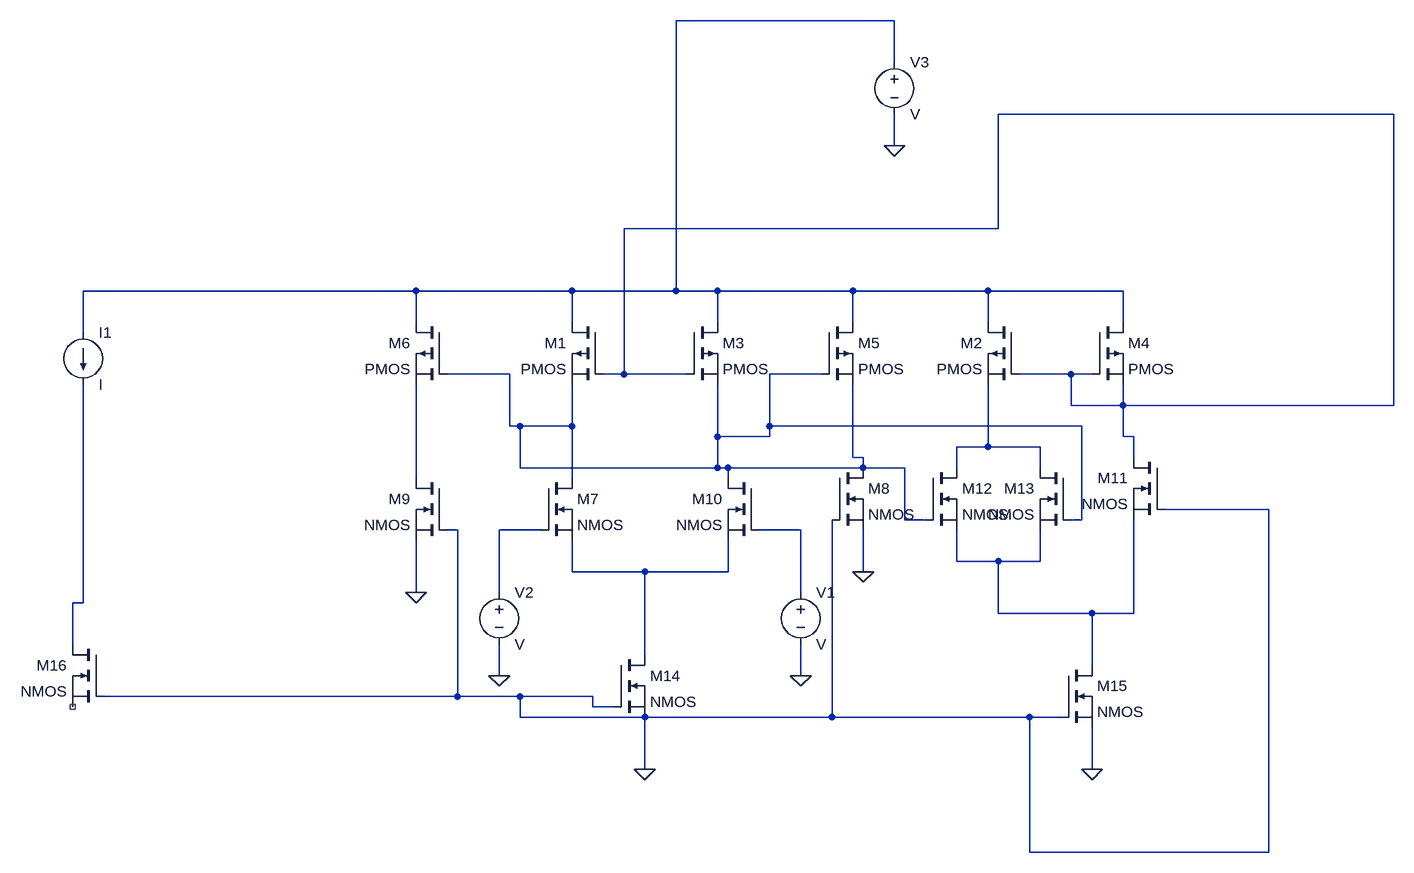
[diagram p0: schematic cmfb_error_amplifier.asc]
cmfb_error_amplifier.asc, the LTspice schematic file:
Version 4
SHEET 1 1284 740
WIRE 512 -544 176 -544
WIRE 512 -480 512 -544
WIRE 1280 -400 672 -400
WIRE 512 -352 512 -400
WIRE 672 -224 672 -400
WIRE 672 -224 96 -224
WIRE -224 -128 -736 -128
WIRE 16 -128 -224 -128
WIRE 176 -128 176 -544
WIRE 176 -128 16 -128
WIRE 240 -128 176 -128
WIRE 448 -128 240 -128
WIRE 656 -128 448 -128
WIRE 864 -128 656 -128
WIRE -224 -80 -224 -128
WIRE 16 -80 16 -128
WIRE 240 -80 240 -128
WIRE 448 -80 448 -128
WIRE 656 -80 656 -128
WIRE 864 -80 864 -128
WIRE -736 -64 -736 -128
WIRE -80 0 -176 0
WIRE 96 0 96 -224
WIRE 96 0 64 0
WIRE 192 0 96 0
WIRE 400 0 320 0
WIRE 784 0 704 0
WIRE 816 0 784 0
WIRE 784 48 784 0
WIRE 864 48 864 16
WIRE 864 48 784 48
WIRE 1280 48 1280 -400
WIRE 1280 48 864 48
WIRE -80 80 -80 0
WIRE -64 80 -80 80
WIRE 16 80 16 16
WIRE 16 80 -64 80
WIRE 320 80 320 0
WIRE 800 80 320 80
WIRE 240 96 240 16
WIRE 320 96 320 80
WIRE 320 96 240 96
WIRE 864 96 864 48
WIRE 880 96 864 96
WIRE 656 112 656 16
WIRE 656 112 608 112
WIRE 736 112 656 112
WIRE 448 128 448 16
WIRE 464 128 448 128
WIRE 880 128 880 96
WIRE -64 144 -64 80
WIRE 240 144 240 96
WIRE 240 144 -64 144
WIRE 256 144 240 144
WIRE 464 144 464 128
WIRE 464 144 256 144
WIRE 528 144 464 144
WIRE 608 144 608 112
WIRE 736 144 736 112
WIRE -224 160 -224 16
WIRE 16 160 16 80
WIRE 256 160 256 144
WIRE 1088 208 928 208
WIRE 528 224 528 144
WIRE 560 224 528 224
WIRE 800 224 800 80
WIRE 800 224 784 224
WIRE -160 240 -176 240
WIRE -32 240 -96 240
WIRE 368 240 304 240
WIRE 608 288 608 240
WIRE 672 288 608 288
WIRE 736 288 736 240
WIRE 736 288 672 288
WIRE 16 304 16 256
WIRE 128 304 16 304
WIRE 256 304 256 256
WIRE 256 304 128 304
WIRE 464 304 464 240
WIRE -224 336 -224 256
WIRE -96 336 -96 240
WIRE 368 336 368 240
WIRE -736 352 -736 16
WIRE -736 352 -752 352
WIRE 672 368 672 288
WIRE 816 368 672 368
WIRE 880 368 880 224
WIRE 880 368 816 368
WIRE -752 416 -752 352
WIRE 128 432 128 304
WIRE 816 448 816 368
WIRE -96 464 -96 416
WIRE 368 464 368 416
WIRE -160 496 -160 240
WIRE -160 496 -704 496
WIRE -64 496 -160 496
WIRE 48 496 -64 496
WIRE 48 512 48 496
WIRE 80 512 48 512
WIRE -64 528 -64 496
WIRE 128 528 -64 528
WIRE 416 528 416 224
WIRE 416 528 128 528
WIRE 720 528 416 528
WIRE 768 528 720 528
WIRE 128 608 128 528
WIRE 816 608 816 544
WIRE 720 736 720 528
WIRE 1088 736 1088 208
WIRE 1088 736 720 736
FLAG 128 608 0
FLAG 816 608 0
FLAG -96 464 0
FLAG 368 464 0
FLAG -224 336 0
FLAG 464 304 0
FLAG 512 -352 0
SYMBOL pmos 64 -80 M0
SYMATTR InstName M1
SYMBOL pmos 704 -80 M0
SYMATTR InstName M2
SYMBOL pmos 192 -80 R0
SYMATTR InstName M3
SYMBOL pmos 816 -80 R0
SYMATTR InstName M4
SYMBOL pmos 400 -80 R0
SYMATTR InstName M5
SYMBOL pmos -176 -80 M0
SYMATTR InstName M6
SYMBOL nmos -32 160 R0
SYMATTR InstName M7
SYMBOL nmos 416 144 R0
SYMATTR InstName M8
SYMBOL nmos -176 160 M0
SYMATTR InstName M9
SYMBOL nmos 304 160 M0
SYMATTR InstName M10
SYMBOL nmos 928 128 M0
SYMATTR InstName M11
SYMBOL nmos 560 144 R0
SYMATTR InstName M12
SYMBOL nmos 784 144 M0
SYMATTR InstName M13
SYMBOL nmos 80 432 R0
SYMATTR InstName M14
SYMBOL nmos 768 448 R0
SYMATTR InstName M15
SYMBOL voltage 368 320 R0
SYMATTR InstName V1
SYMBOL voltage -96 320 R0
SYMATTR InstName V2
SYMBOL voltage 512 -496 R0
SYMATTR InstName V3
SYMBOL current -736 -64 R0
SYMATTR InstName I1
SYMBOL nmos -704 416 M0
SYMATTR InstName M16

The netlist it stands for:
* cmfb_error_amplifier.asc
M1 N001 N002 N003 N003 PMOS
M2 N001 N002 N004 N004 PMOS
M3 N001 N002 N003 N003 PMOS
M4 N001 N002 N002 N002 PMOS
M5 N001 N003 N003 N003 PMOS
M6 N001 N003 N005 N005 PMOS
M7 N003 N006 N009 N009 NMOS
M8 N003 0 0 0 NMOS
M9 N005 0 0 0 NMOS
M10 N003 N007 N009 N009 NMOS
M11 N002 0 N008 N008 NMOS
M12 N004 N003 N008 N008 NMOS
M13 N004 N003 N008 N008 NMOS
M14 N009 0 0 0 NMOS
M15 N008 0 0 0 NMOS
V1 N007 0 V
V2 N006 0 V
V3 N001 0 V
I1 N001 N010 I
M16 N010 0 NC_01 NC_01 NMOS
.model NMOS NMOS
.model PMOS PMOS
.lib standard.mos
.backanno
.end